# Altium schematic sheet FPGA.SchDoc
size A3; SheetNumber: 4; SheetTotal: 10
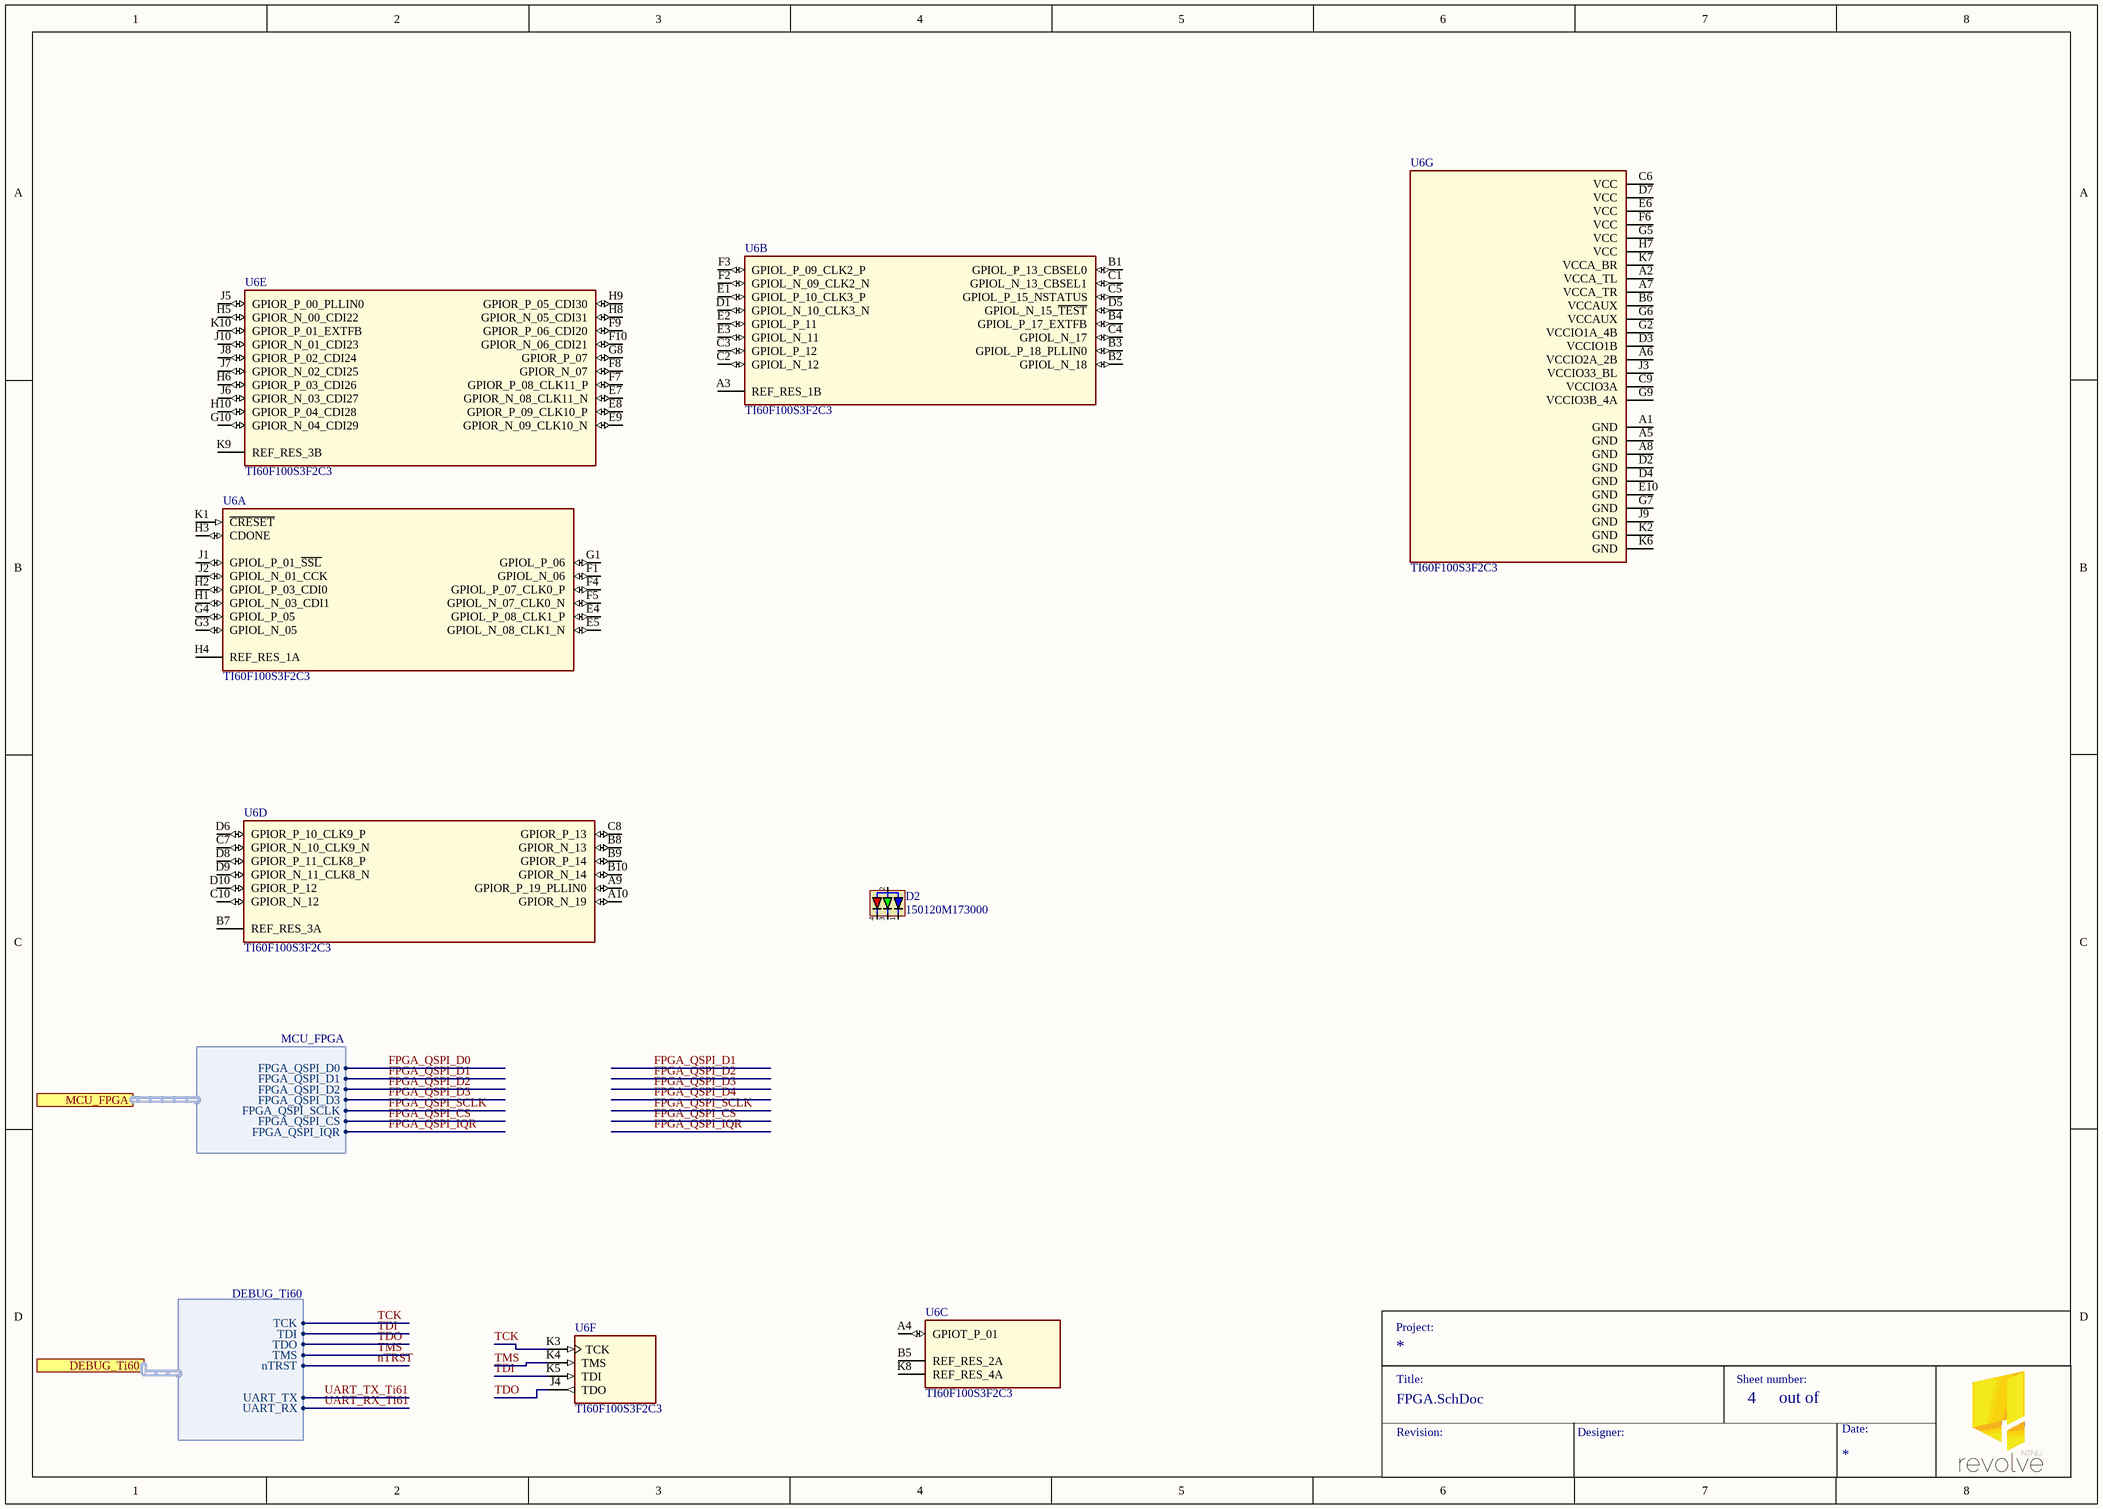
[diagram p0: FPGA.SchDoc]

## Parts
D2  150120M173000  [150120M173000-Footprint-1]
U6  TI60F100S3F2C3  [IC_TI60F100S3F2C3]  (parts A,B,C,D,E,F,G of 7)

## Ports
DEBUG_Ti60 (harness DEBUG_Ti60), MCU_FPGA (harness MCU_FPGA)

## Harnesses
DEBUG_Ti60: TCK, TDI, TDO, TMS, nTRST, UART_TX, UART_RX
MCU_FPGA: FPGA_QSPI_D0, FPGA_QSPI_D1, FPGA_QSPI_D2, FPGA_QSPI_D3, FPGA_QSPI_SCLK, FPGA_QSPI_CS, FPGA_QSPI_IQR

## Nets
FPGA_QSPI_CS: port MCU_FPGA.FPGA_QSPI_CS
FPGA_QSPI_D0: port MCU_FPGA.FPGA_QSPI_D0
FPGA_QSPI_D1: port MCU_FPGA.FPGA_QSPI_D1
FPGA_QSPI_D2: port MCU_FPGA.FPGA_QSPI_D2
FPGA_QSPI_D3: port MCU_FPGA.FPGA_QSPI_D3
FPGA_QSPI_IQR: port MCU_FPGA.FPGA_QSPI_IQR
FPGA_QSPI_SCLK: port MCU_FPGA.FPGA_QSPI_SCLK
nTRST: port DEBUG_Ti60.nTRST
TCK: U6.K3(TCK) ; port DEBUG_Ti60.TCK
TDI: U6.K5(TDI) ; port DEBUG_Ti60.TDI
TDO: U6.J4(TDO) ; port DEBUG_Ti60.TDO
TMS: U6.K4(TMS) ; port DEBUG_Ti60.TMS
UART_RX_Ti61: port DEBUG_Ti60.UART_RX
UART_TX_Ti61: port DEBUG_Ti60.UART_TX

Not connected (* = marked no-connect by the designer): D2 1(5) 2(Anode) 3(4) 4(3); U6 A1(GND) A2(VCCA_TL) A3(REF_RES_1B) A4(GPIOT_P_01) A5(GND) A6(VCCIO2A_2B) A7(VCCA_TR) A8(GND) A9(GPIOR_P_19_PLLIN0) A10(GPIOR_N_19) B1(GPIOL_P_13_CBSEL0) B2(GPIOL_N_18) B3(GPIOL_P_18_PLLIN0) B4(GPIOL_P_17_EXTFB) B5(REF_RES_2A) B6(VCCAUX) B7(REF_RES_3A) B8(GPIOR_N_13) B9(GPIOR_P_14) B10(GPIOR_N_14) C1(GPIOL_N_13_CBSEL1) C2(GPIOL_N_12) C3(GPIOL_P_12) C4(GPIOL_N_17) C5(GPIOL_P_15_NSTATUS) C6(VCC) C7(GPIOR_N_10_CLK9_N) C8(GPIOR_P_13) C9(VCCIO3A) C10(GPIOR_N_12) D1(GPIOL_N_10_CLK3_N) D2(GND) D3(VCCIO1B) D4(GND) D5(GPIOL_N_15_~{TEST}) D6(GPIOR_P_10_CLK9_P) D7(VCC) D8(GPIOR_P_11_CLK8_P) D9(GPIOR_N_11_CLK8_N) D10(GPIOR_P_12) E1(GPIOL_P_10_CLK3_P) E2(GPIOL_P_11) E3(GPIOL_N_11) E4(GPIOL_P_08_CLK1_P) E5(GPIOL_N_08_CLK1_N) E6(VCC) E7(GPIOR_N_08_CLK11_N) E8(GPIOR_P_09_CLK10_P) E9(GPIOR_N_09_CLK10_N) E10(GND) F1(GPIOL_N_06) F2(GPIOL_N_09_CLK2_N) F3(GPIOL_P_09_CLK2_P) F4(GPIOL_P_07_CLK0_P) F5(GPIOL_N_07_CLK0_N) F6(VCC) F7(GPIOR_P_08_CLK11_P) F8(GPIOR_N_07) F9(GPIOR_P_06_CDI20) F10(GPIOR_N_06_CDI21) G1(GPIOL_P_06) G2(VCCIO1A_4B) G3(GPIOL_N_05) G4(GPIOL_P_05) G5(VCC) G6(VCCAUX) G7(GND) G8(GPIOR_P_07) G9(VCCIO3B_4A) G10(GPIOR_N_04_CDI29) H1(GPIOL_N_03_CDI1) H2(GPIOL_P_03_CDI0) H3(CDONE) H4(REF_RES_1A) H5(GPIOR_N_00_CDI22) H6(GPIOR_P_03_CDI26) H7(VCC) H8(GPIOR_N_05_CDI31) H9(GPIOR_P_05_CDI30) H10(GPIOR_P_04_CDI28) J1(GPIOL_P_01_~{SSL}) J2(GPIOL_N_01_CCK) J3(VCCIO33_BL) J5(GPIOR_P_00_PLLIN0) J6(GPIOR_N_03_CDI27) J7(GPIOR_N_02_CDI25) J8(GPIOR_P_02_CDI24) J9(GND) J10(GPIOR_N_01_CDI23) K1(~{CRESET}) K2(GND) K6(GND) K7(VCCA_BR) K8(REF_RES_4A) K9(REF_RES_3B) K10(GPIOR_P_01_EXTFB)

## Notes on the sheet
- Project:
- Title:
- Sheet number:
- Revision:
- Designer:
- out of
- Date:

## Library data of the parts
D2 = CMP-001-M81-1: 1206 RGB LED Wurth
U6 = CMP-001-0000-1: FPGA Titan 61HSIO 3PLL 100BGA; PartId: 1